# EAGLE schematic TransmitterSchematic (EAGLE 6.5.0)
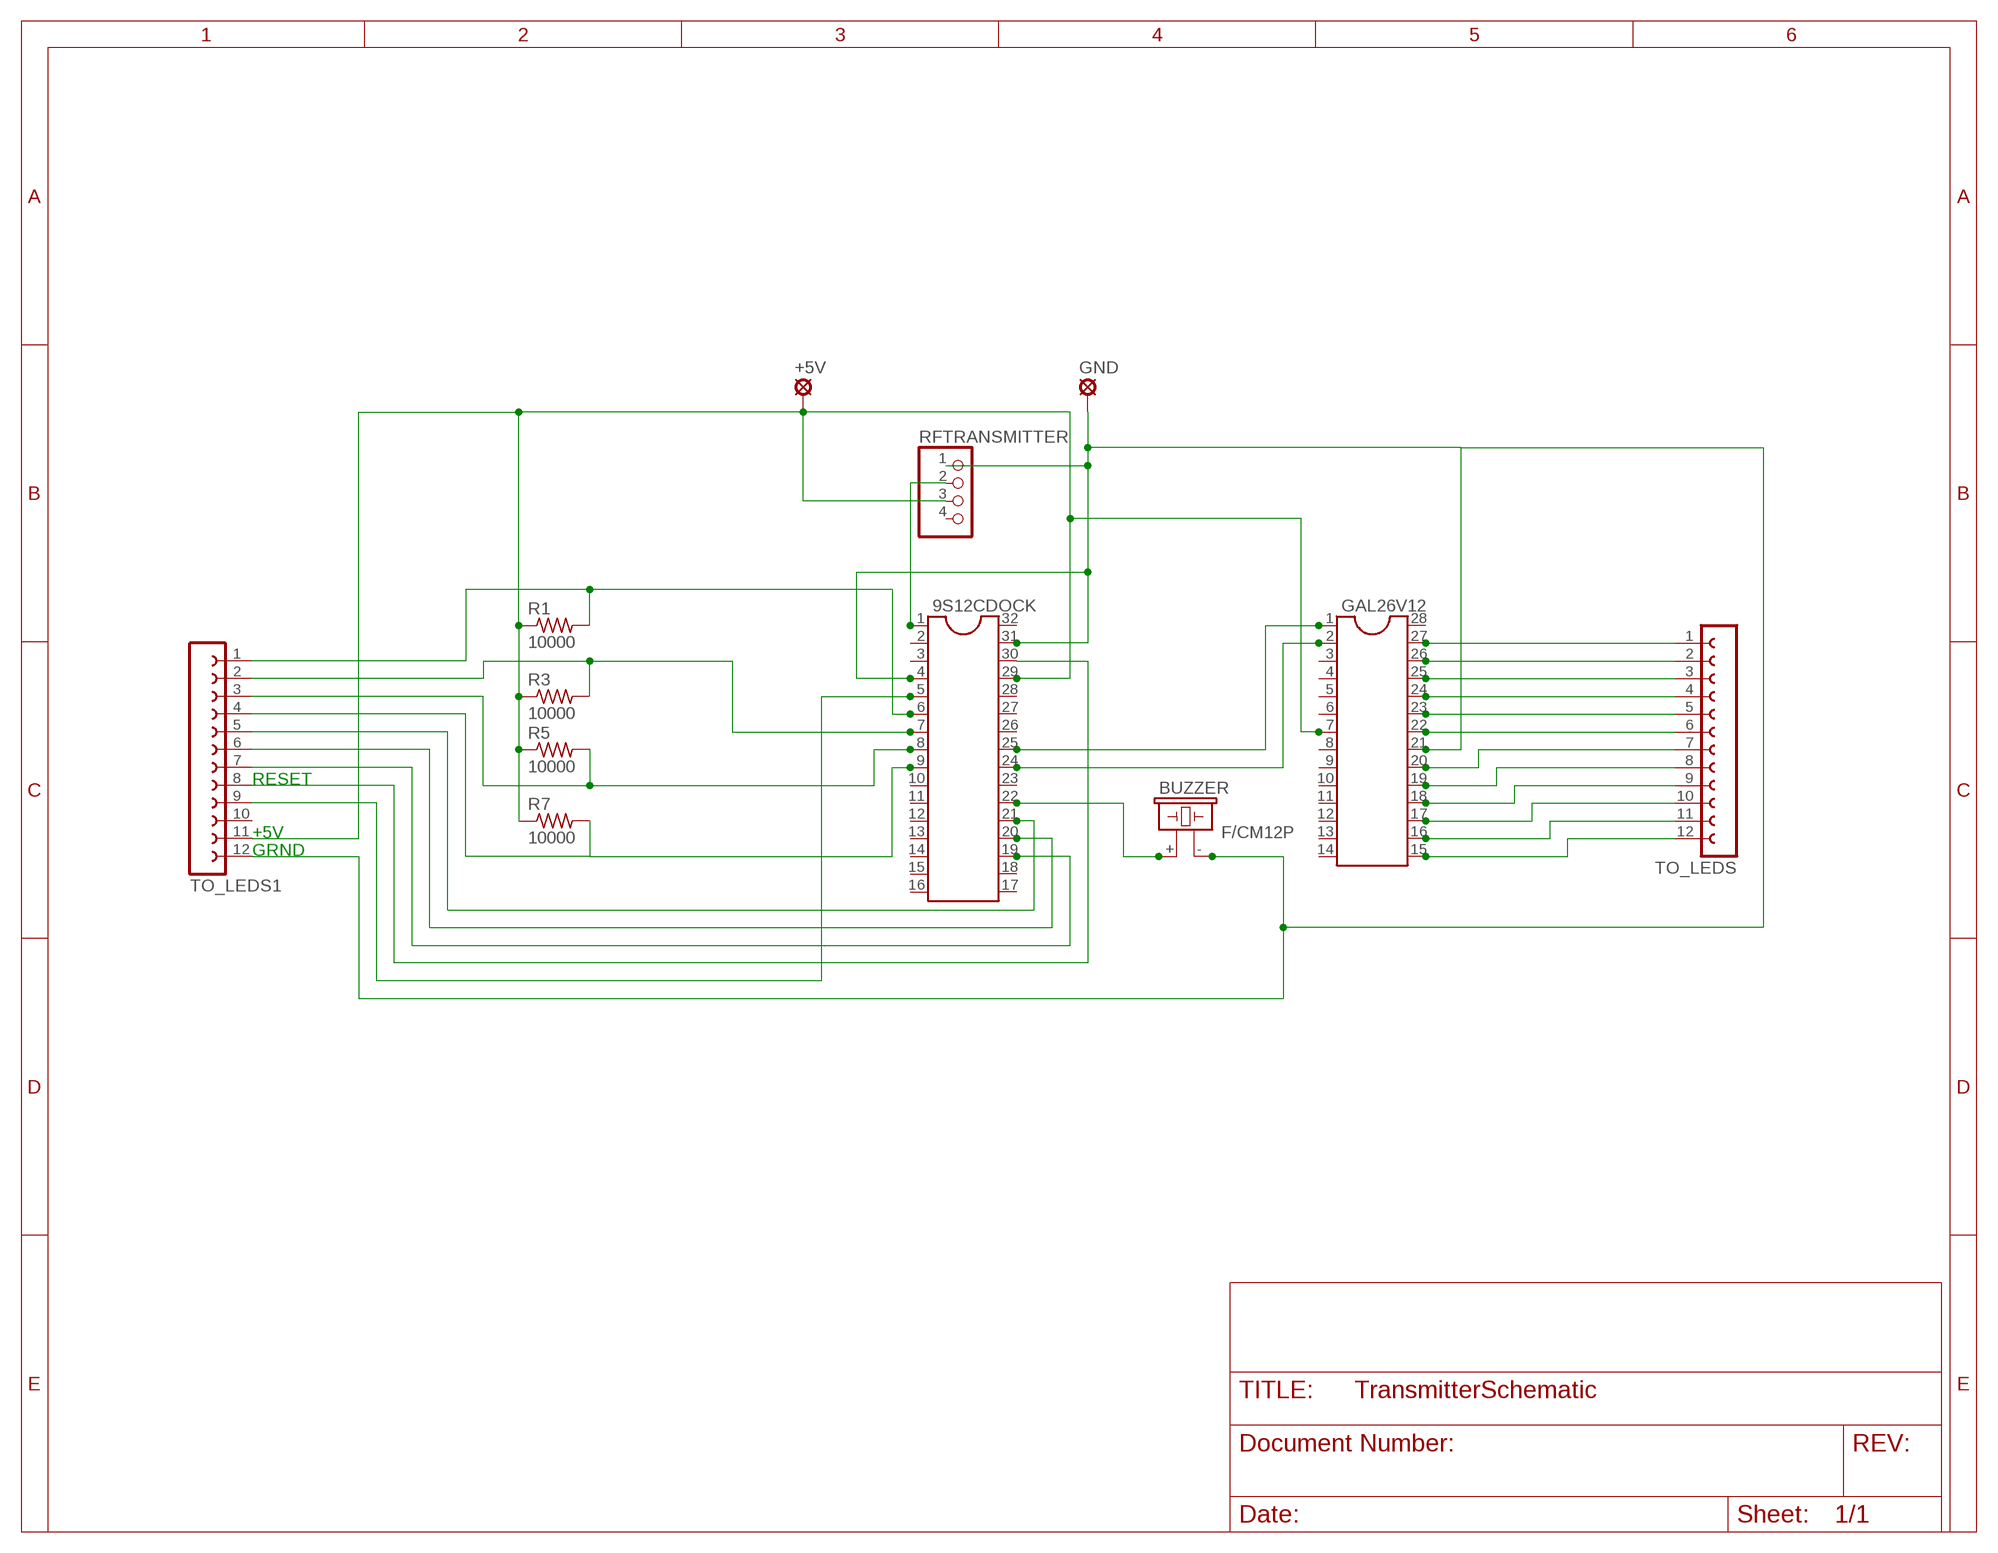
[diagram p0: schematic, sheet 1]

## Parts
9S12CDOCK  DIL32  [DIL32]
+5V  LSP10  [LSP10]
BUZZER  F/CM12P  [F/CM12P]
GAL26V12  DIL28  [DIL28-6]
GND  LSP10  [LSP10]
R1  10000  R-US_0204/5  [0204/5]
R3  10000  R-US_0204/5  [0204/5]
R5  10000  R-US_0204/5  [0204/5]
R7  10000  R-US_0204/5  [0204/5]
RFTRANSMITTER  PINHD-1X4  [1X04]
TO_LEDS  FE12-1  [FE12]
TO_LEDS1  FE12-1  [FE12]

## Nets
N$1: 9S12CDOCK.1 RFTRANSMITTER.2
N$2: 9S12CDOCK.7 R3.2 TO_LEDS1.2
N$3: 9S12CDOCK.8 R5.2 TO_LEDS1.3
N$4: 9S12CDOCK.9 R7.2 TO_LEDS1.4
N$5: 9S12CDOCK.20 TO_LEDS1.6
N$6: GAL26V12.27 TO_LEDS.1
N$7: 9S12CDOCK.21 TO_LEDS1.5
N$8: 9S12CDOCK.6 R1.2 TO_LEDS1.1
N$9: 9S12CDOCK.19 TO_LEDS1.7
N$10: 9S12CDOCK.30 TO_LEDS1.8
N$11: 9S12CDOCK.25 GAL26V12.1
N$12: 9S12CDOCK.24 GAL26V12.2
N$13: 9S12CDOCK.29 +5V.MP GAL26V12.7 R1.1 R3.1 R5.1 R7.1 RFTRANSMITTER.3 TO_LEDS1.11
N$14: GAL26V12.24 TO_LEDS.4
N$15: GAL26V12.23 TO_LEDS.5
N$16: GAL26V12.22 TO_LEDS.6
N$17: GAL26V12.20 TO_LEDS.7
N$18: GAL26V12.19 TO_LEDS.8
N$19: GAL26V12.17 TO_LEDS.10
N$21: GAL26V12.15 TO_LEDS.12
N$22: GAL26V12.16 TO_LEDS.11
N$23: GAL26V12.26 TO_LEDS.2
N$24: GAL26V12.25 TO_LEDS.3
N$25: 9S12CDOCK.22 BUZZER.+
N$26: 9S12CDOCK.5 TO_LEDS1.9
N$27: 9S12CDOCK.4 9S12CDOCK.31 BUZZER.- GAL26V12.21 GND.MP RFTRANSMITTER.1 TO_LEDS1.12
N$28: GAL26V12.18 TO_LEDS.9
Unconnected: 9S12CDOCK.2 9S12CDOCK.3 9S12CDOCK.10 9S12CDOCK.11 9S12CDOCK.12 9S12CDOCK.13 9S12CDOCK.14 9S12CDOCK.15 9S12CDOCK.16 9S12CDOCK.17 9S12CDOCK.18 9S12CDOCK.23 9S12CDOCK.26 9S12CDOCK.27 9S12CDOCK.28 9S12CDOCK.32 GAL26V12.3 GAL26V12.4 GAL26V12.5 GAL26V12.6 GAL26V12.8 GAL26V12.9 GAL26V12.10 GAL26V12.11 GAL26V12.12 GAL26V12.13 GAL26V12.14 GAL26V12.28 RFTRANSMITTER.4 TO_LEDS1.10

## Notes on the sheet
- RESET
- +5V
- GRND

## Library data of the parts
9S12CDOCK = ic-package:DIL32: Dual In Line
+5V GND = solpad:LSP10: SOLDER PAD drill 1.0 mm, distributor Buerklin, 12H555
BUZZER = buzzer:F/CM12P: BUZZER Source: Buerklin; OC_FARNELL: unknown; OC_NEWARK: unknown
GAL26V12 = ic-package:DIL28: Dual In Line
R1 R3 R5 R7 = resistor:R-US_: RESISTOR, American symbol
RFTRANSMITTER = pinhead:PINHD-1X4: PIN HEADER
TO_LEDS TO_LEDS1 = con-lsta:FE12-1: FEMALE HEADER; OC_FARNELL: unknown; OC_NEWARK: unknown